# Altium schematic sheet 01_Powersupply.SchDoc
size A3
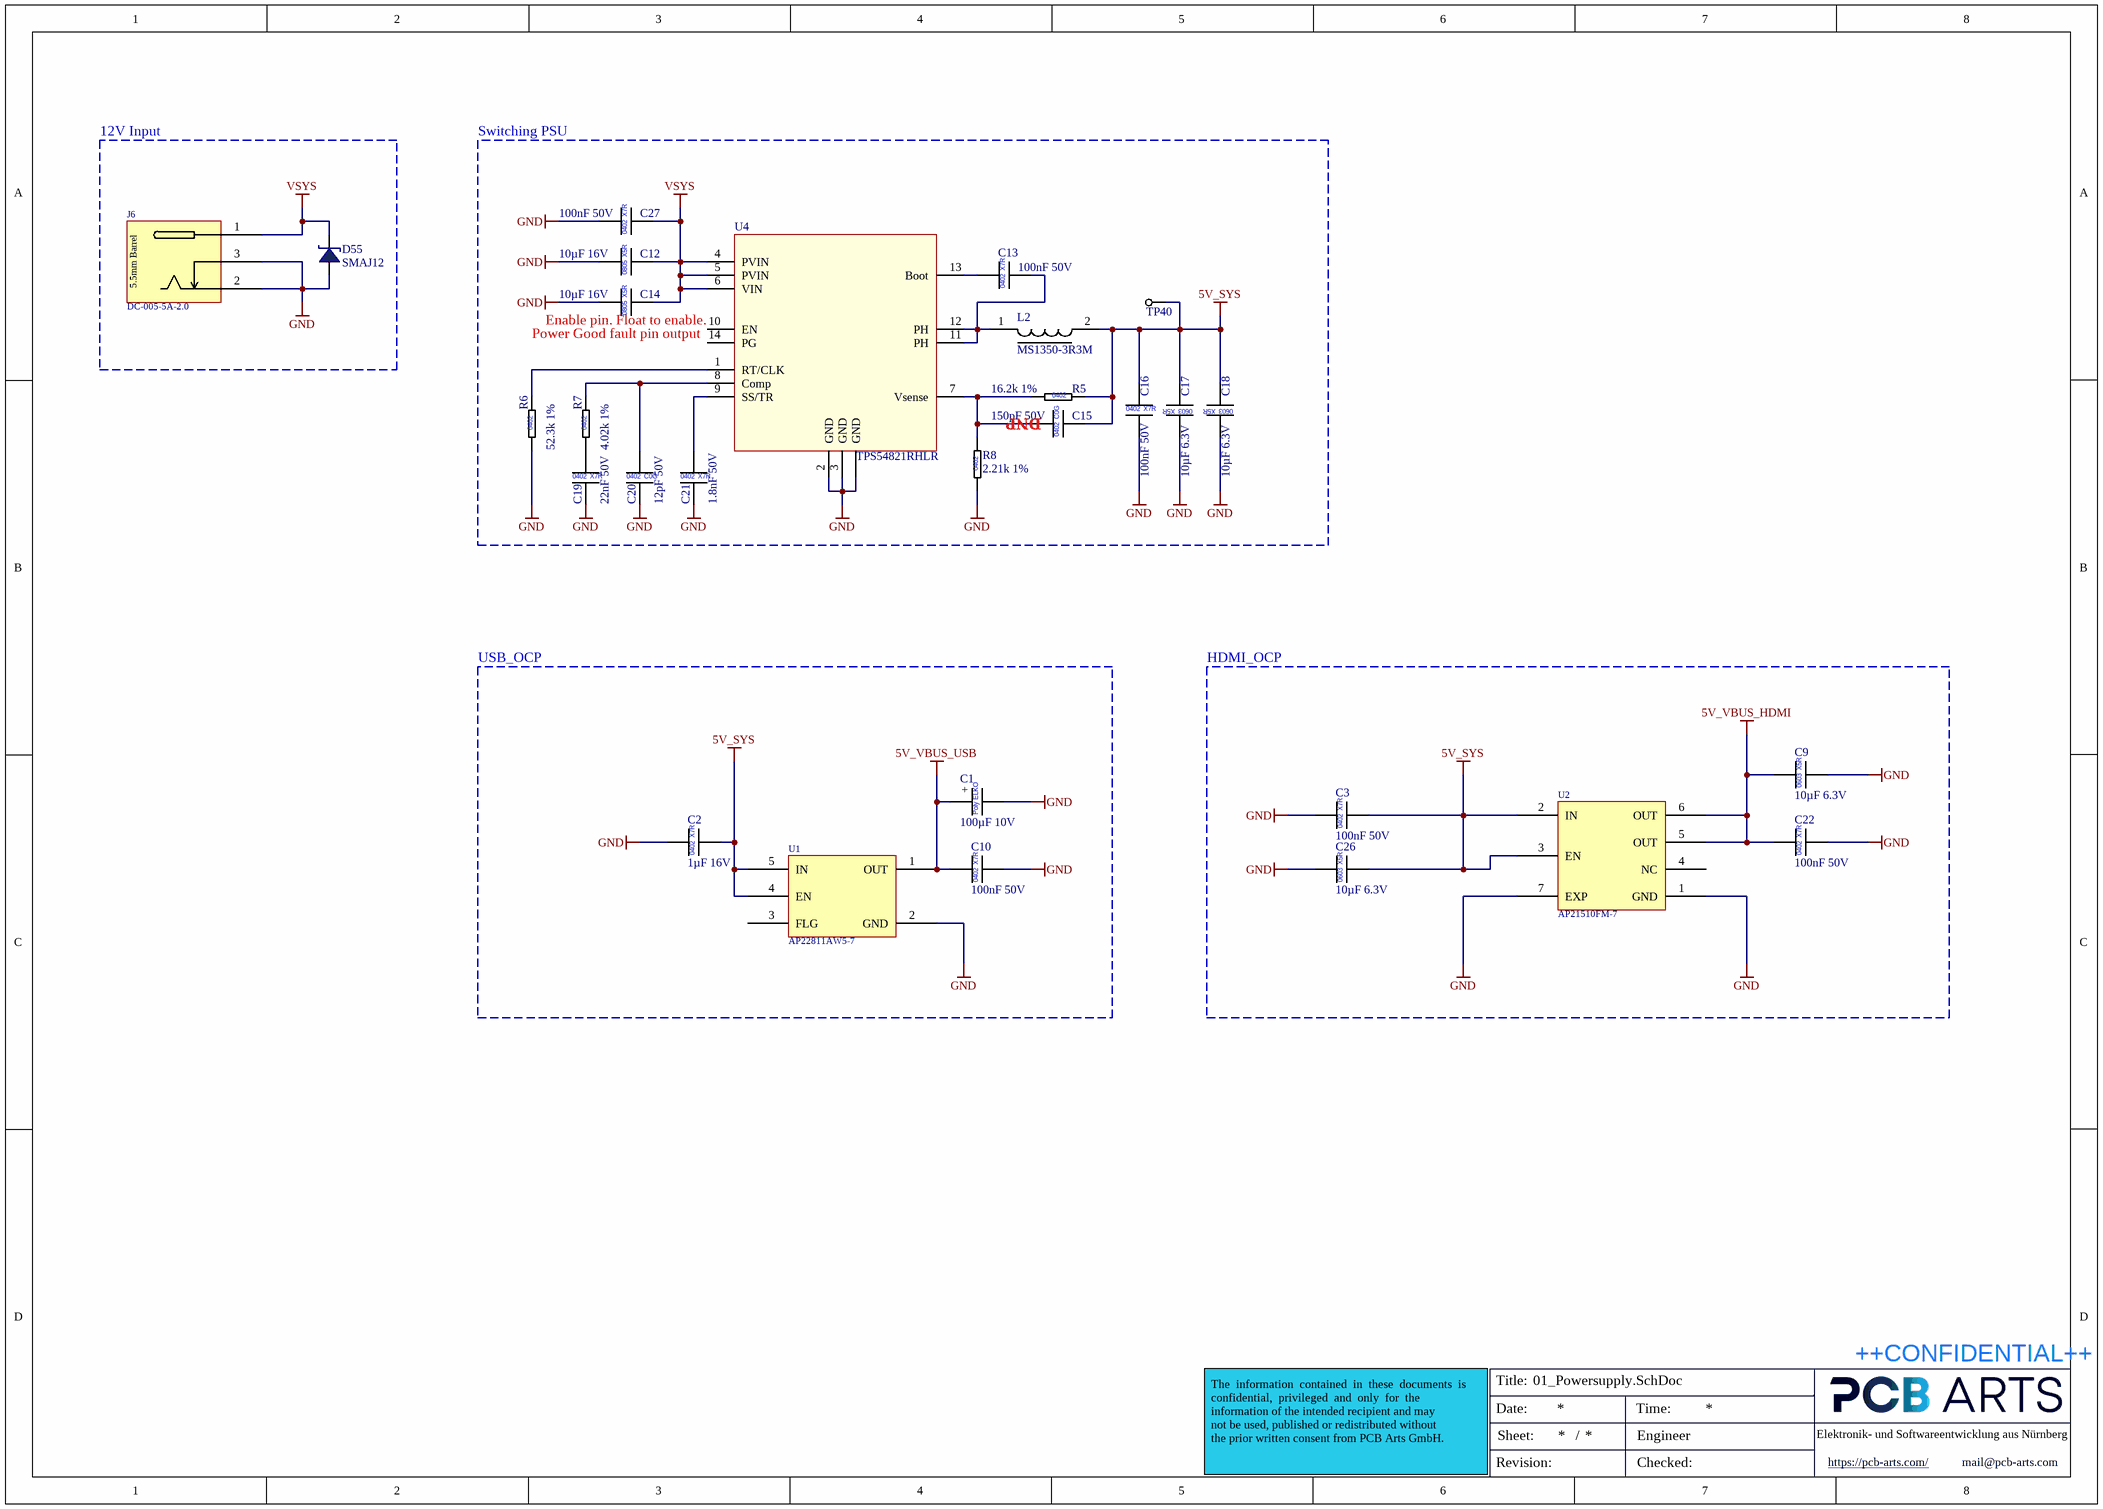
[diagram p0: 01_Powersupply.SchDoc]

## Parts
C1  100µF 10V  [WCAP-ASLI_D5H5.5]
C2  1µF 16V  [CAP_0402]
C3  100nF 50V  [CAP_0402]
C9  10µF 6.3V  [CAP_0603]
C10  100nF 50V  [CAP_0402]
C12  10µF 16V  [CAP_0805]
C13  100nF 50V  [CAP_0402]
C14  10µF 16V  [CAP_0805]
C15  150pF 50V  [CAP_0402]  (no BOM)
C16  100nF 50V  [CAP_0402]
C17  10µF 6.3V  [CAP_0603]
C18  10µF 6.3V  [CAP_0603]
C19  22nF 50V  [CAP_0402]
C20  12pF 50V  [CAP_0402]
C21  1.8nF 50V  [CAP_0402]
C22  100nF 50V  [CAP_0402]
C26  10µF 6.3V  [CAP_0603]
C27  100nF 50V  [CAP_0402]
D55  SMAJ12  [DO214AC]
J6  DC-005-5A-2.0  [DC-005-5A-2.0]
L2  MS1350-3R3M  [MS1350]
R5  16.2k 1%  [RES_0402]
R6  52.3k 1%  [RES_0402]
R7  4.02k 1%  [RES_0402]
R8  2.21k 1%  [RES_0402]
TP40  Testpoint  [Testpoint 0.8mm]  (value not drawn)  (no BOM)
U1  AP22811AW5-7  [SOT95P285X140-5N]
U2  AP21510FM-7  [QFN50P201X181X60_HS-7N]
U4  TPS54821RHLR  [VQFN14U3535]

## Blocks framed on the sheet
12V Input: D55 J6
DNP: C12-C21 C27 L2 R5-R8 TP40 U4
USB_OCP: C1 C2 C10 U1
HDMI_OCP: C3 C9 C22 C26 U2

## Nets
5V_SYS: C2.2 C3.2 C15.2 C16.1 C17.2 C18.2 C26.2 L2.2 R5.2 TP40.1(GND) U1.4(EN) U1.5(IN) U2.2(IN) U2.3(EN)
5V_VBUS_HDMI: C9.1 C22.1 U2.5(OUT) U2.6(OUT)
5V_VBUS_USB: C1.1 C10.1 U1.1(OUT)
GND: C1.2 C2.1 C3.1 C9.2 C10.2 C12.1 C14.1 C16.2 C17.1 C18.1 C19.2 C20.2 C21.2 C22.2 C26.1 C27.1 D55.2 J6.2 J6.3 R6.1 R8.1 U1.2(GND) U2.1(GND) U2.7(EXP) U4.2(GND) U4.3(GND) U4.EXP(GND)
VSYS: C12.2 C14.2 C27.2 D55.1 J6.1 U4.4(PVIN) U4.5(PVIN) U4.6(VIN)
NetC13_1: C13.1 U4.13(Boot)
NetC13_2: C13.2 L2.1 U4.11(PH) U4.12(PH)
NetC15_1: C15.1 R5.1 R8.2 U4.7(Vsense)
NetC19_1: C19.1 R7.1
NetC20_1: C20.1 R7.2 U4.8(Comp)
NetC21_1: C21.1 U4.9(SS/TR)
NetR6_2: R6.2 U4.1(RT/CLK)

Not connected (* = marked no-connect by the designer): U1 3(FLG); U2 4(NC); U4 10(EN) 14(PG)

## Notes on the sheet
- Switching PSU
- (near U4) Power Good fault pin output
- (near U4) Enable pin. Float to enable.
- Title:
- ++CONFIDENTIAL++
- Date:
- Sheet:
- /
- Time:
- Engineer
- Elektronik- und Softwareentwicklung aus Nürnberg
- The  information  contained  in  these  documents  is  confidential,  privileged  and  only  for  the
  information of the intended recipient and may
  not be used, published or redistributed without
  the prior written consent from PCB Arts GmbH.
- Revision:
- Checked:
- https://pcb-arts.com/
- mail@pcb-arts.com
- (in symbol CAP_0402_1.8nF_50V) 0402; X7R
- (in symbol CAP_0402_1µF_16V) X7R; 0402
- (in symbol CAP_0402_12pF_50V) 0402; C0G
- (in symbol CAP_0402_22nF_50V) 0402; X7R
- (in symbol CAP_0402_100nF_50V) X7R; 0402
- (in symbol CAP_0402_150pF_50V) C0G; 0402
- (in symbol CAP_0603_10µF_6.3V) X5R; 0603
- (in symbol CAP_0805_10µF_16V) X5R; 0805
- (in symbol CAP_D5L5.5_100µF_10V) +; Poly ELKO
- (in symbol DC-005-5A-2.0_DC Power Receptacle Jack 5.5/2.1mm) 5.5mm Barrel
- (in symbol RES_0402_2.21k_1%) 0402
- (in symbol RES_0402_4.02k_1%) 0402
- (in symbol RES_0402_16.2k_1%) 0402
- (in symbol RES_0402_52.3k_1%) 0402

## Library data of the parts
C1 = CAP_D5L5.5_100µF_10V: Organische Polymer-Aluminiumkondensatoren 100uF 10 Volts 20%; Manufacturer 1: Würth Elektronik; Manufacturer 1 Prt. Nr.: 875105242010
C2 = CAP_0402_1µF_16V: Multilayer Ceramic Capacitors MLCC - SMD/SMT 0402 16VDC; Manufacturer 1: Taiyo Yuden; Manufacturer 1 Prt. Nr.: EMK105BJ105MVHF; Manufacturer 2 Prt. Nr.: GRM155R61E105KA12D; Manufacturer 2: Murata Electronics
C3 C10 C13 C16 C22 C27 = CAP_0402_100nF_50V: Multilayer Ceramic Capacitors MLCC - SMD/SMT 0402 50VDC; Manufacturer 1: Murata Electronics; Manufacturer 1 Prt. Nr.: GCM155L8EH104KE07D; Manufacturer 2 Prt. Nr.: UMK105B7104KV-FR; Manufacturer 2: TDK
C9 C17 C18 C26 = CAP_0603_10µF_6.3V: Multilayer Ceramic Capacitors MLCC - SMD/SMT 0603 6.3VDC; Manufacturer 1: Murata Electronics; Manufacturer 1 Prt. Nr.: GRM188R60J106ME84J; Manufacturer 2 Prt. Nr.: JMK107ABJ106MA-T; Manufacturer 2: Taiyo Yuden
C12 C14 = CAP_0805_10µF_16V: Multilayer Ceramic Capacitors MLCC - SMD/SMT 0805 16VDC; Manufacturer 1: Taiyo Yuden; Manufacturer 1 Prt. Nr.: EMK212ABJ106KG-T; Manufacturer 2 Prt. Nr.: C2012X5R1C106K085AC; Manufacturer 2: TDK
C15 = CAP_0402_150pF_50V: Multilayer Ceramic Capacitors MLCC - SMD/SMT 0402 50VDC; Manufacturer 1: Murata Electronics; Manufacturer 1 Prt. Nr.: GCM1555C1H151JA16J; Manufacturer 2 Prt. Nr.: C0402C151J5GACTU; Manufacturer 2: KEMET
C19 = CAP_0402_22nF_50V: Multilayer Ceramic Capacitors MLCC - SMD/SMT 0402 50VDC; Manufacturer 1: Murata Electronics; Manufacturer 1 Prt. Nr.: GCM155R71H223KA55D; Manufacturer 2 Prt. Nr.: UMK105B7223KV-FR; Manufacturer 2: TDK
C20 = CAP_0402_12pF_50V: Multilayer Ceramic Capacitors MLCC - SMD/SMT 0402 50VDC; Manufacturer 1: Murata Electronics; Manufacturer 1 Prt. Nr.: GCM1555C1H120JA16J; Manufacturer 2 Prt. Nr.: C0402C120J5GACTU; Manufacturer 2: KEMET
C21 = CAP_0402_1.8nF_50V: Multilayer Ceramic Capacitors MLCC - SMD/SMT 0402 50VDC; Manufacturer 1: Yageo; Manufacturer 1 Prt. Nr.: CC0402JRX7R9BB182; Manufacturer 2 Prt. Nr.: GCM155R71H182JA37D; Manufacturer 2: Murata Electronics
D55 = SMAJ12_TVS Diode, 12V, Unidirectional: TVS Diode, 12V, Unidirectional; Manufacturer 1: Littelfuse; Manufacturer 1 Prt. Nr.: SMAJ12A
J6 = DC-005-5A-2.0_DC Power Receptacle Jack 5.5/2.1mm: DC Power Receptacle Jack 5.5/2.1mm; Manufacturer 1: XKB Enterprise; Manufacturer 1 Prt. Nr.: DC-005-5A-2.0
L2 = MS1350-3R3M  _3.3uH ±20% 13A 7.5mΩ SMD,13.8x12.6x5mm Inductor: 3.3uH ±20% 13A 7.5mΩ SMD,13.8x12.6x5mm Inductor; Manufacturer 1: COILMX; Manufacturer 1 Prt. Nr.: MS1350-3R3M
R5 = RES_0402_16.2k_1%: Thick Film Resistors - SMD 16.2kOhm 1%; Manufacturer 1: Vishay / Dale; Manufacturer 1 Prt. Nr.: CRCW040216K2FKED; Manufacturer 2 Prt. Nr.: RC0402FR-0716K2L; Manufacturer 2: Yageo
R6 = RES_0402_52.3k_1%: Thick Film Resistors - SMD 52.3kOhm 1%; Manufacturer 1: Vishay / Dale; Manufacturer 1 Prt. Nr.: CRCW040252K3FKEDC; Manufacturer 2 Prt. Nr.: AC0402FR-0752K3L; Manufacturer 2: Yageo
R7 = RES_0402_4.02k_1%: Thick Film Resistors - SMD 4.02kOhm 1%; Manufacturer 1: Vishay / Dale; Manufacturer 1 Prt. Nr.: CRCW04024K02FKEDC; Manufacturer 2 Prt. Nr.: ERJ-2RKF4021X; Manufacturer 2: Panasonic
R8 = RES_0402_2.21k_1%: Thick Film Resistors - SMD 2.21kOhm 1%; Manufacturer 1: Vishay / Dale; Manufacturer 1 Prt. Nr.: CRCW04022K21FKEDC; Manufacturer 2 Prt. Nr.: RC0402FR-7W2K21L; Manufacturer 2: Yageo
TP40 = Testpoint 0.8mm
U1 = AP22811AW5-7_Power Switch ICs - Power Distribution Load Switch: Power Switch ICs - Power Distribution Load Switch; Manufacturer 1: Diodes Incorporated; Manufacturer 1 Prt. Nr.: AP22811AW5-7
U2 = AP21510FM-7_Power Switch ICs - Power Distribution Load Switch: Power Switch ICs - Power Distribution 0.5A SGL Ch USB 2.0 Curr Limited Switch; Manufacturer 1: Diodes Incorporated; Manufacturer 1 Prt. Nr.: AP21510FM-7
U4 = TPS54821RHLR_4.5 V to 17 V Input, 8 A Synchronous Step Down Converter: 4.5 V to 17 V Input, 8 A Synchronous Step Down Converter; Manufacturer 1: Texas Instruments; Manufacturer 1 Prt. Nr.: TPS54821RHLR